# Altium schematic sheet motion_sensor.SchDoc
size 297 x 209 mm; DrawnBy: Supun; Engineer: Supun; Organization: C3
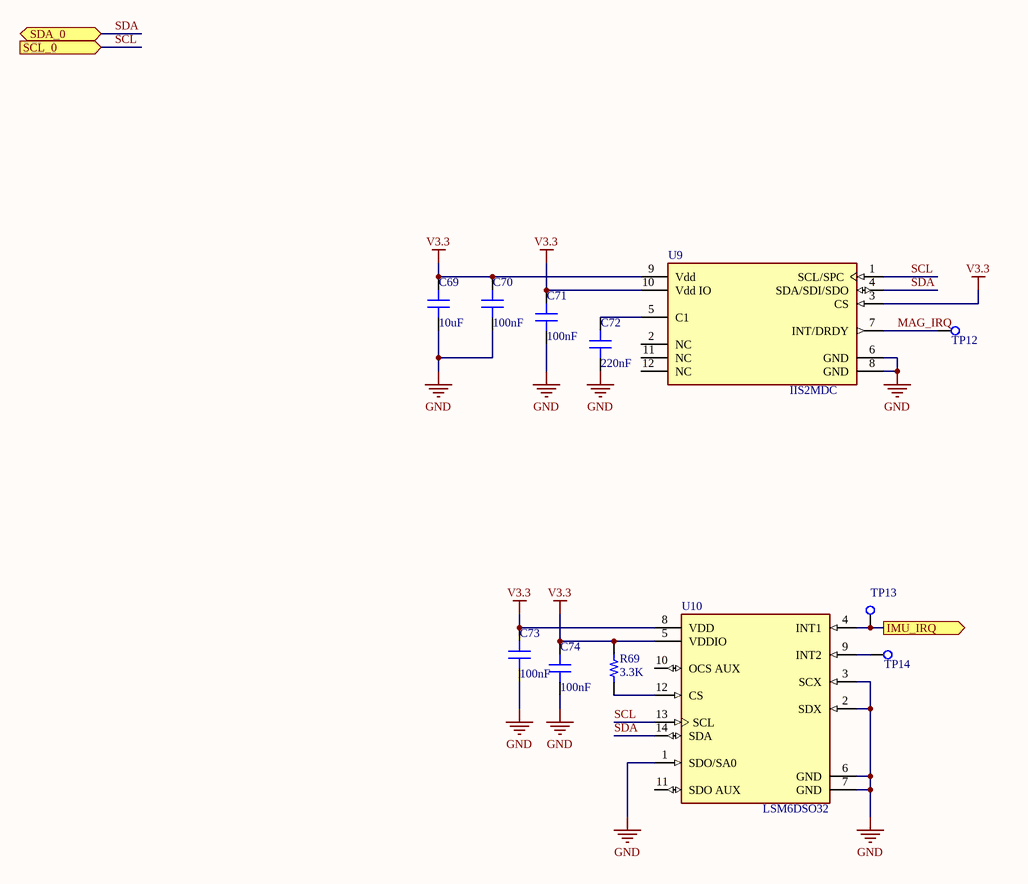
[diagram p0: motion_sensor.SchDoc]

## Parts
C69  10uF  [CAP 0603_1608]
C70  100nF  [CAP 0603_1608]
C71  100nF  [CAP 0603_1608]
C72  220nF  [CAP 0603_1608]
C73  100nF  [CAP 0603_1608]
C74  100nF  [CAP 0603_1608]
R69  3.3K  [RES 0603_1608]
TP12  Test Point  [TPSMD_S1]  (value not drawn)
TP13  Test Point  [TPSMD_S1]  (value not drawn)
TP14  Test Point  [TPSMD_S1]  (value not drawn)
U9  IIS2MDC  [STMicroelectronics_LGA-12-DM00170568_MFG]
U10  LSM6DSO32  [STMicroelectronics_LGA-14L-DM00249496_MFG]

## Ports
IMU_IRQ (out), SCL_0 (in), SDA_0 (bidir)

## Nets
GND: C69.2 C70.2 C71.2 C72.2 C73.2 C74.2 U9.6(GND) U9.8(GND) U10.1(SDO/SA0) U10.2(SDX) U10.3(SCX) U10.6(GND) U10.7(GND)
V3.3: C69.1 C70.1 C71.1 C73.1 C74.1 R69.2 U9.3(CS) U9.9(Vdd) U9.10(Vdd_IO) U10.5(VDDIO) U10.8(VDD)
IMU_IRQ: TP13.1(TP) U10.4(INT1) ; port IMU_IRQ
MAG_IRQ: TP12.1(TP) U9.7(INT/DRDY)
SCL: U9.1(SCL/SPC) U10.13(SCL) ; port SCL_0
SDA: U9.4(SDA/SDI/SDO) U10.14(SDA) ; port SDA_0
NetC72_1: C72.1 U9.5(C1)
NetR69_1: R69.1 U10.12(CS)
NetTP14_1: TP14.1(TP) U10.9(INT2)

Not connected (* = marked no-connect by the designer): U9 2(NC) 11(NC) 12(NC); U10 10(OCS_AUX) 11(SDO_AUX)

## Notes on the sheet
- Title
- Size:
- Date:
- A4
- Number:
- Time:
- Revision:
- Sheet
- of
- File:

## Library data of the parts
C69 = Capacitor: SMT Capacitor; MF: Murata; MP: GRM188R61C106MAALD; Value: 10uF; Link: https://www.mouser.com/ProductDetail/Murata-Electronics/GRM188R61C106MAALD?qs=hNud%2FORuBR3LEOKZ4RJp9w%3D%3D
C70 C71 C73 C74 = Capacitor: SMT Capacitor; MF: TDK; MP: CGA3E2X7R1E104K080AA; Value: 100nF; Link: https://www.mouser.com/ProductDetail/TDK/CGA3E2X7R1E104K080AA?qs=NRhsANhppD%2Fm7%2FOmmsm0vg%3D%3D
C72 = Capacitor: SMT Capacitor; MF: Samsung; MP: CL10B224KO8NNNC; Value: 220nF; Link: https://www.mouser.com/ProductDetail/Samsung-Electro-Mechanics/CL10B224KO8NNNC?qs=349EhDEZ59ovd%252B6gRVIaTg%3D%3D
R69 = Resistor: SMT Resistor; MF: YAGEO; MP: AC0603FR-073K3L; Value: 3.3K; Link: https://www.mouser.com/ProductDetail/YAGEO/AC0603FR-073K3L?qs=yhV1fb9g%2FKZasQ4U0IUUCA%3D%3D
U9 = IIS2MDCTR: Board Mount Hall Effect / Magnetic Sensors High accuracy, ultra-low-power ,3-axis digital output magnetometer; MF: STMicroelectronics; MP: IIS2MDCTR; Link: https://www.mouser.com/ProductDetail/STMicroelectronics/IIS2MDCTR?qs=1mbolxNpo8ems1K%2FRdQzXg%3D%3D
U10 = LSM6DSOTR: Inertial Measurement Unit, 6-axis, I2C, SPI, 1.7V-3.6V; MF: STMicroelectronics; MP: LSM6DSO32TR; Link: https://www.mouser.com/ProductDetail/STMicroelectronics/LSM6DSO32TR?qs=rI7uf1IzohQPdukPhHG9Gw%3D%3D
TP12-TP14 = Test Point: Link: https://